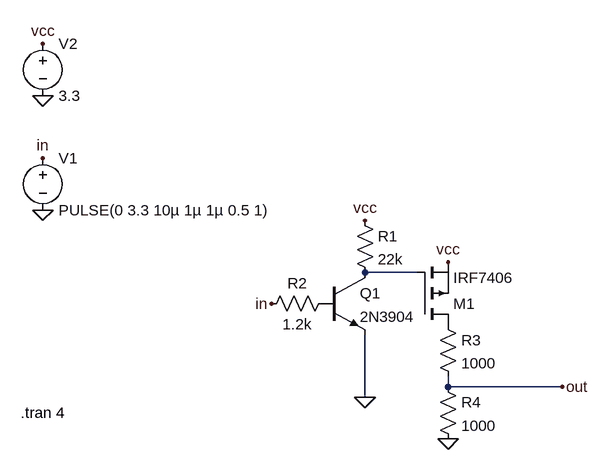
[diagram p0: schematic Draft1.asc]
Draft1.asc, the LTspice schematic file:
Version 4
SHEET 1 880 680
WIRE 224 192 144 192
WIRE 272 368 272 352
WIRE 448 368 272 368
WIRE 144 384 144 288
FLAG 144 112 vcc
FLAG 144 384 0
FLAG 272 176 vcc
FLAG 0 240 in
FLAG -352 96 0
FLAG -352 16 in
FLAG -352 -80 0
FLAG -352 -160 vcc
FLAG 272 448 0
FLAG 448 368 out
SYMBOL res 128 96 R0
SYMATTR InstName R1
SYMATTR Value 22k
SYMBOL res 96 224 R90
WINDOW 0 0 56 VBottom 2
WINDOW 3 32 56 VTop 2
SYMATTR InstName R2
SYMATTR Value 1.2k
SYMBOL npn 80 192 R0
SYMATTR InstName Q1
SYMATTR Value 2N3904
SYMBOL pmos 224 272 M180
SYMATTR InstName M1
SYMATTR Value IRF7406
SYMBOL voltage -352 0 R0
WINDOW 123 0 0 Left 0
WINDOW 39 0 0 Left 0
SYMATTR InstName V1
SYMATTR Value PULSE(0 3.3 10µ 1µ 1µ 0.5 1)
SYMBOL voltage -352 -176 R0
WINDOW 123 0 0 Left 0
WINDOW 39 0 0 Left 0
SYMATTR InstName V2
SYMATTR Value 3.3
SYMBOL res 256 256 R0
SYMATTR InstName R3
SYMATTR Value 1000
SYMBOL res 256 352 R0
SYMATTR InstName R4
SYMATTR Value 1000
TEXT -386 408 Left 2 !.tran 4

The netlist it stands for:
* Draft1.asc
R1 vcc N001 22k
R2 P001 in 1.2k
Q1 N001 P001 0 0 2N3904
M1 P002 N001 vcc vcc IRF7406
V1 in 0 PULSE(0 3.3 10µ 1µ 1µ 0.5 1)
V2 vcc 0 3.3
R3 P002 out 1000
R4 out 0 1000
.model NPN NPN
.model PNP PNP
.lib standard.bjt
.model NMOS NMOS
.model PMOS PMOS
.lib standard.mos
.tran 4
.backanno
.end

* Results of the author's LTspice run, read from the files saved beside the schematic
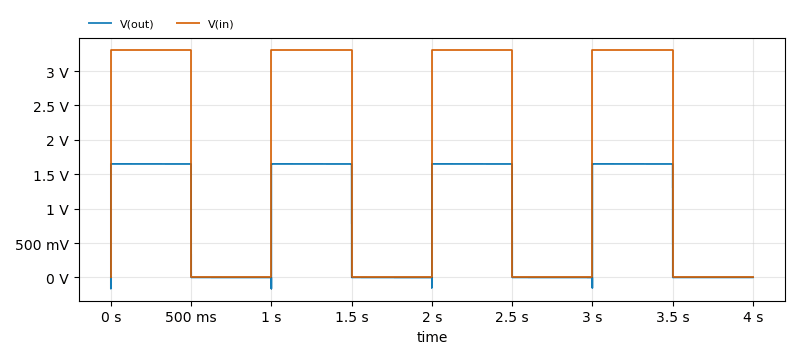
[diagram p1: Transient Analysis of Draft1.asc, plotted from the saved traces]
* Transient Analysis, 1 run:
*   V(out): min -165 mV, max 1.65 V, average 825.2 mV, rms 1.167 V, last 289.5 nV
*   V(in): min 0 V, max 3.3 V, average 1.65 V, rms 2.333 V, last 0 V